# Altium schematic sheet 0254_GPU POWER SEQUENCI.SchDoc
size 848 x 558 mm
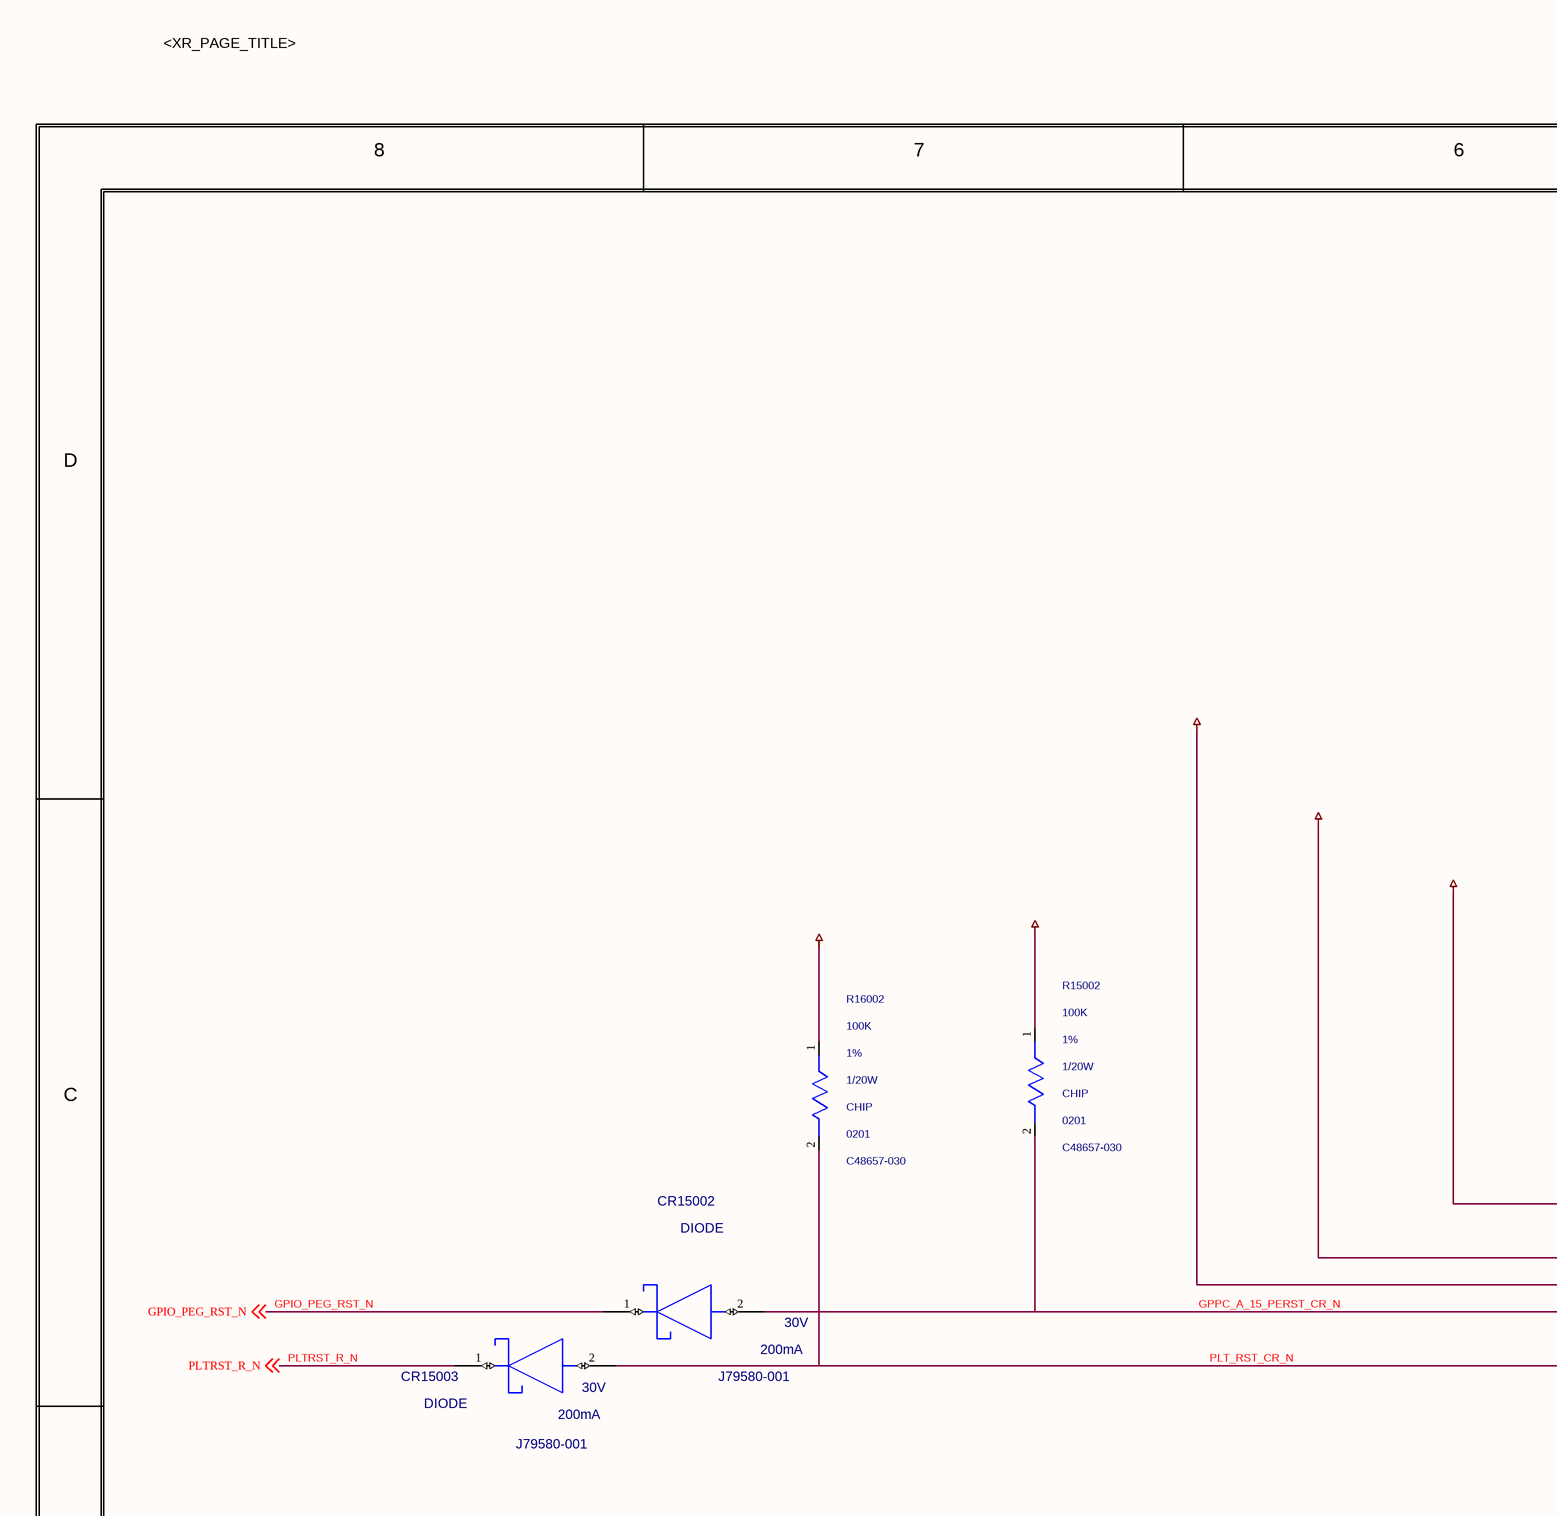
[diagram p0: 0254_GPU POWER SEQUENCI.SchDoc, top left]
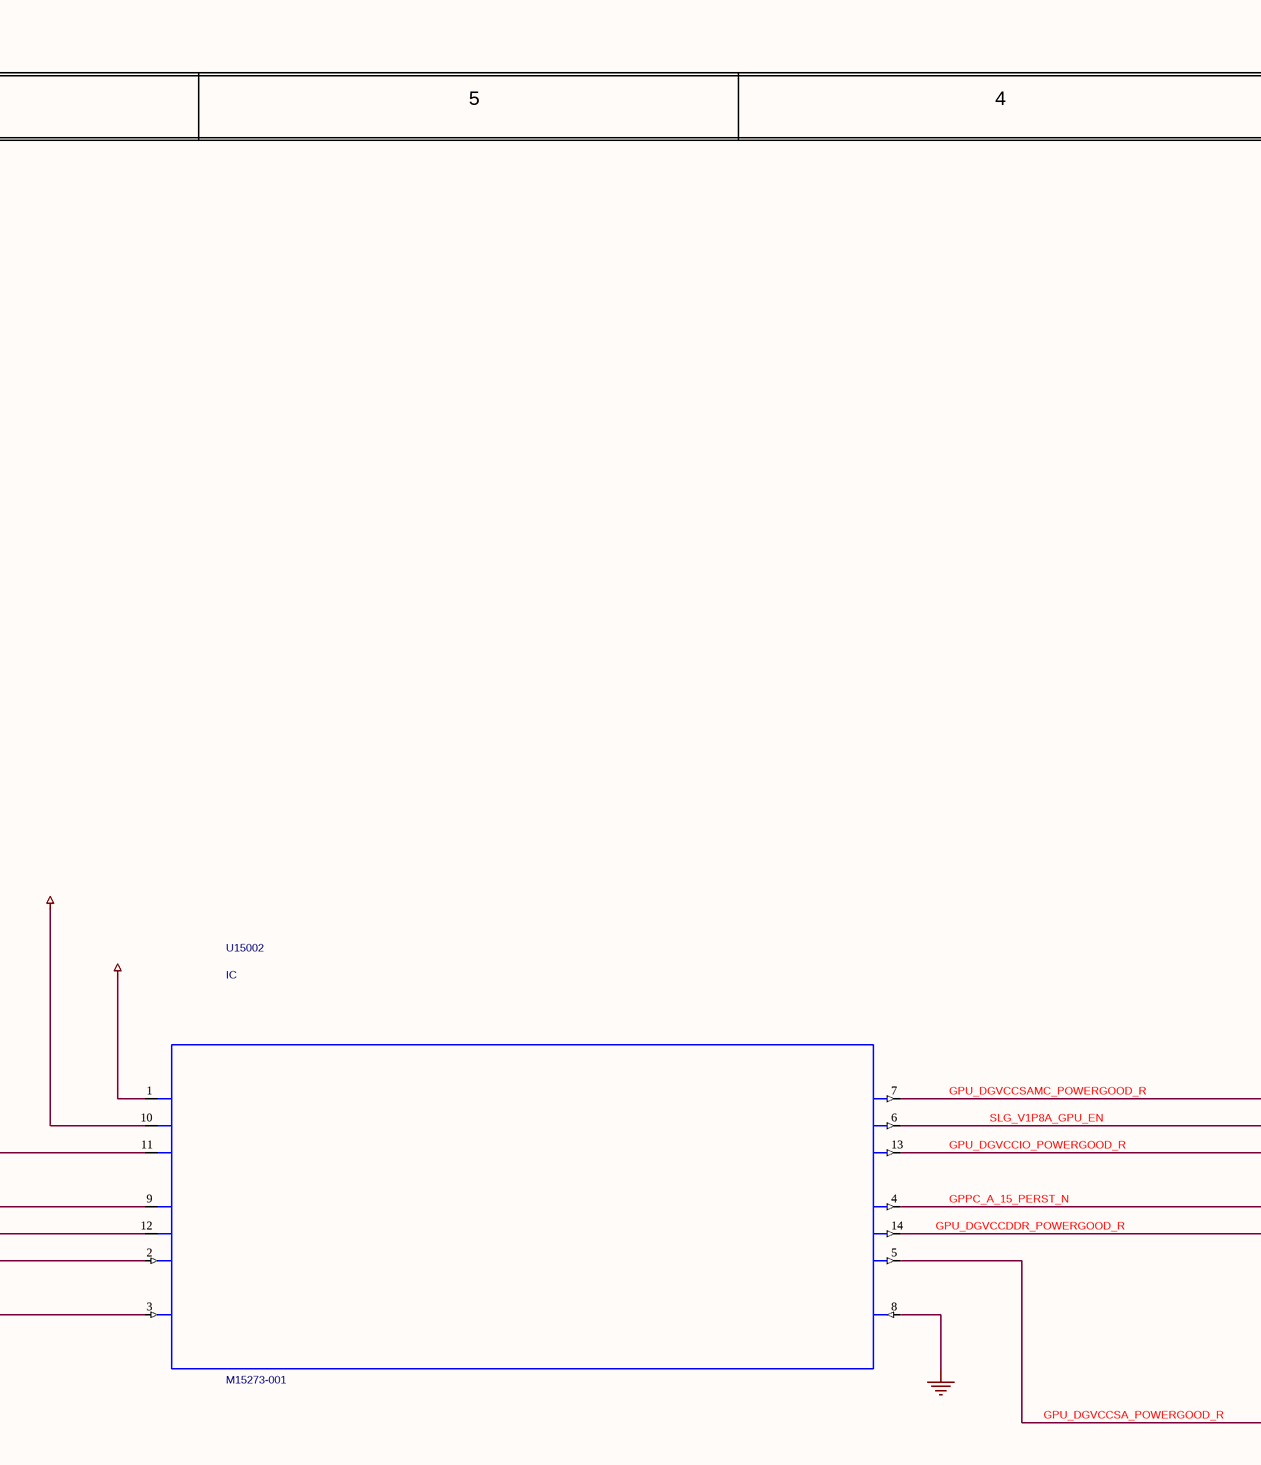
[diagram p1: 0254_GPU POWER SEQUENCI.SchDoc, top middle]
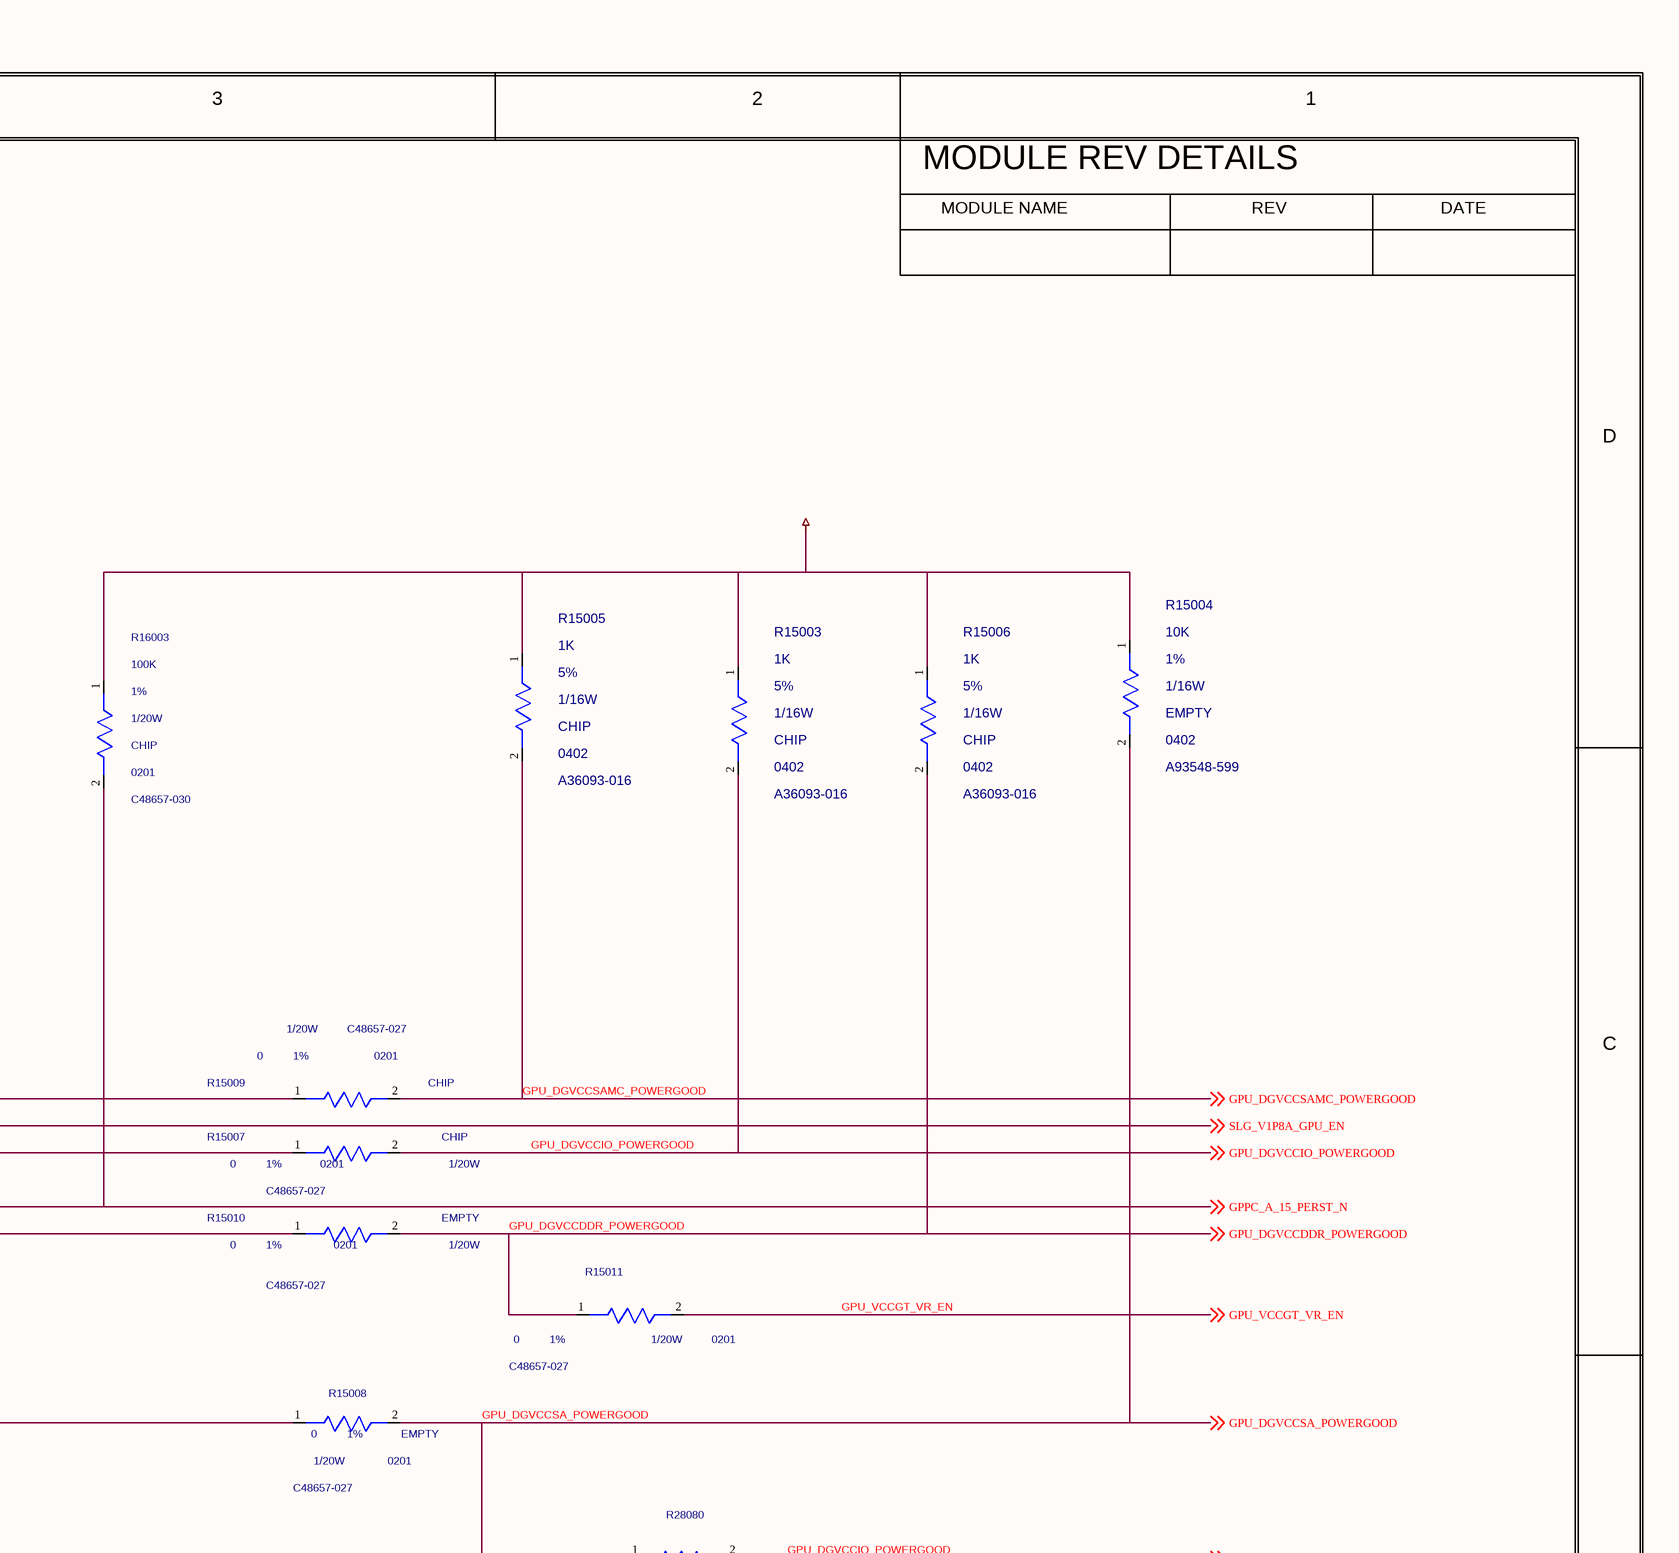
[diagram p2: 0254_GPU POWER SEQUENCI.SchDoc, top right]
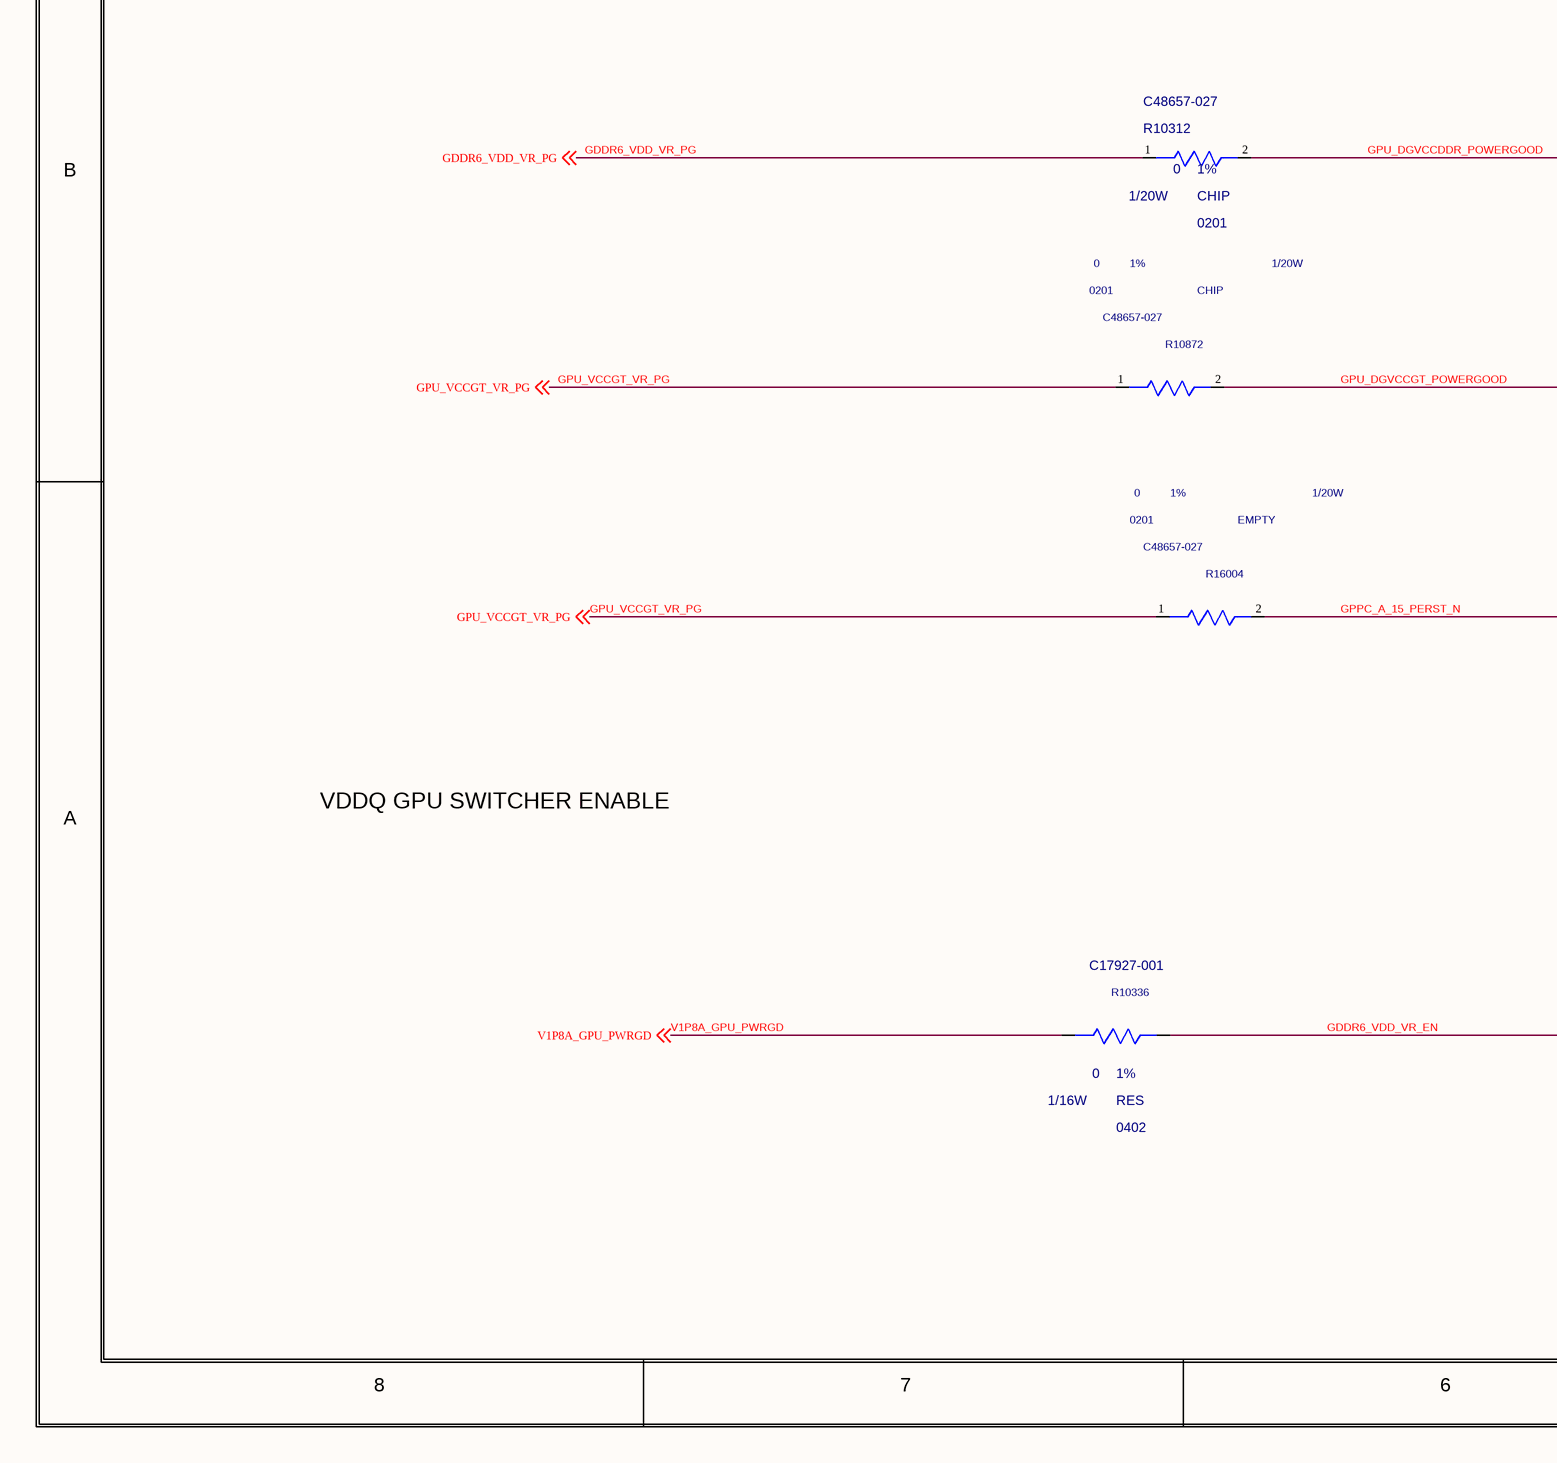
[diagram p3: 0254_GPU POWER SEQUENCI.SchDoc, bottom left]
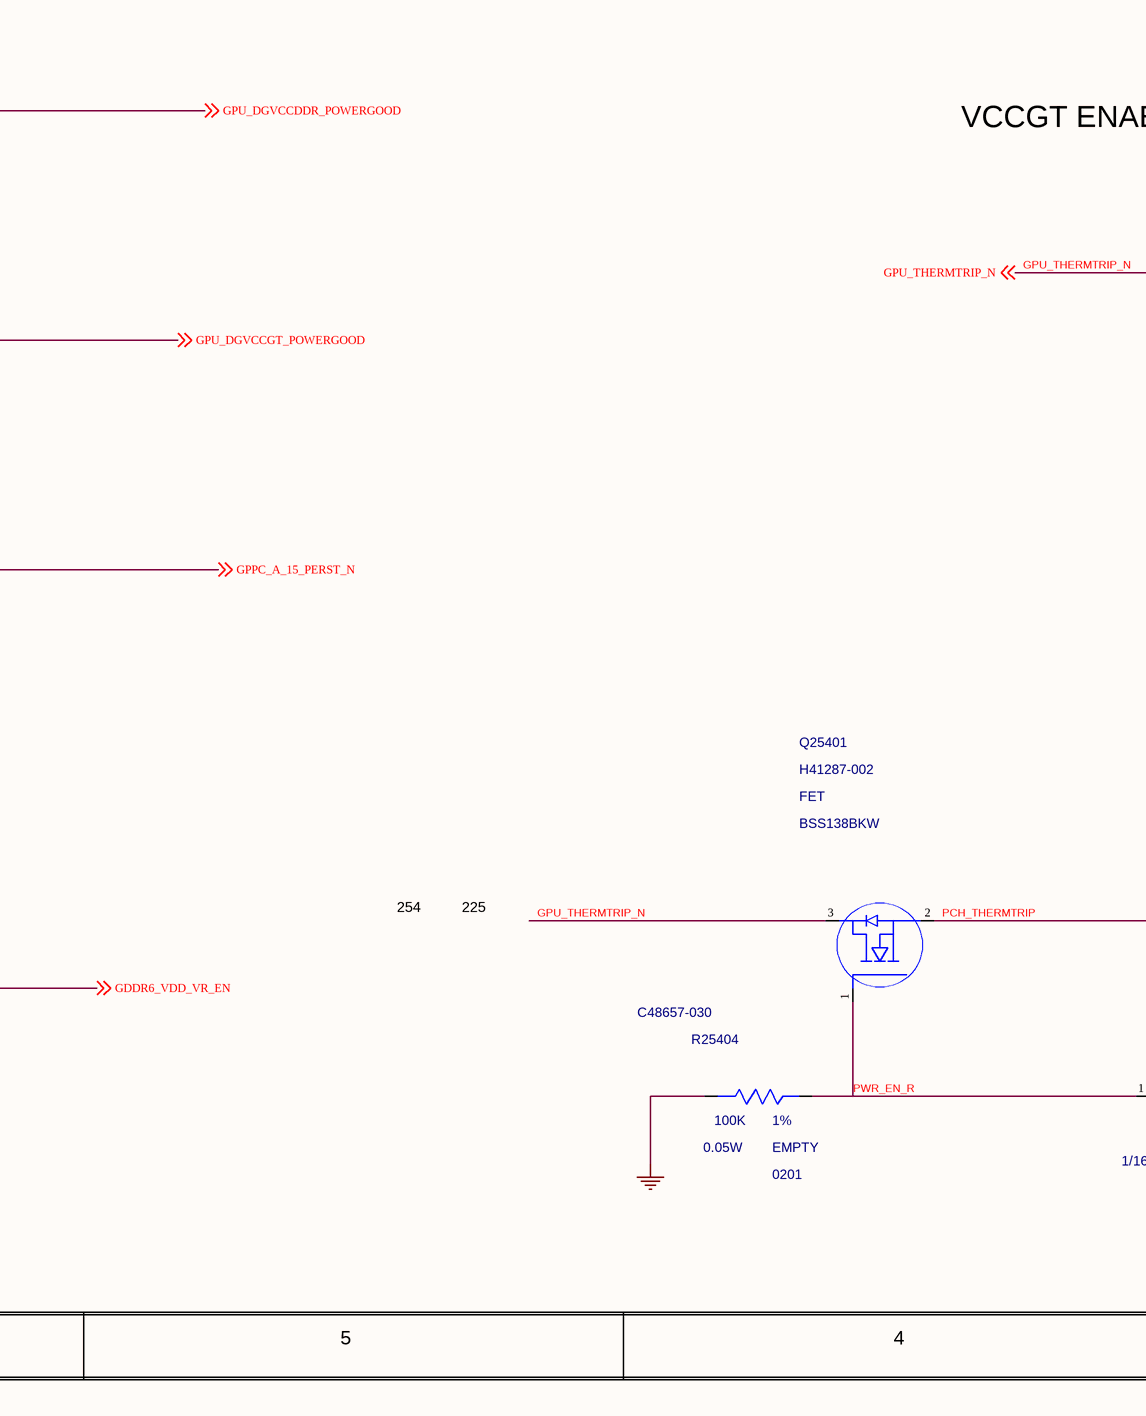
[diagram p4: 0254_GPU POWER SEQUENCI.SchDoc, bottom middle]
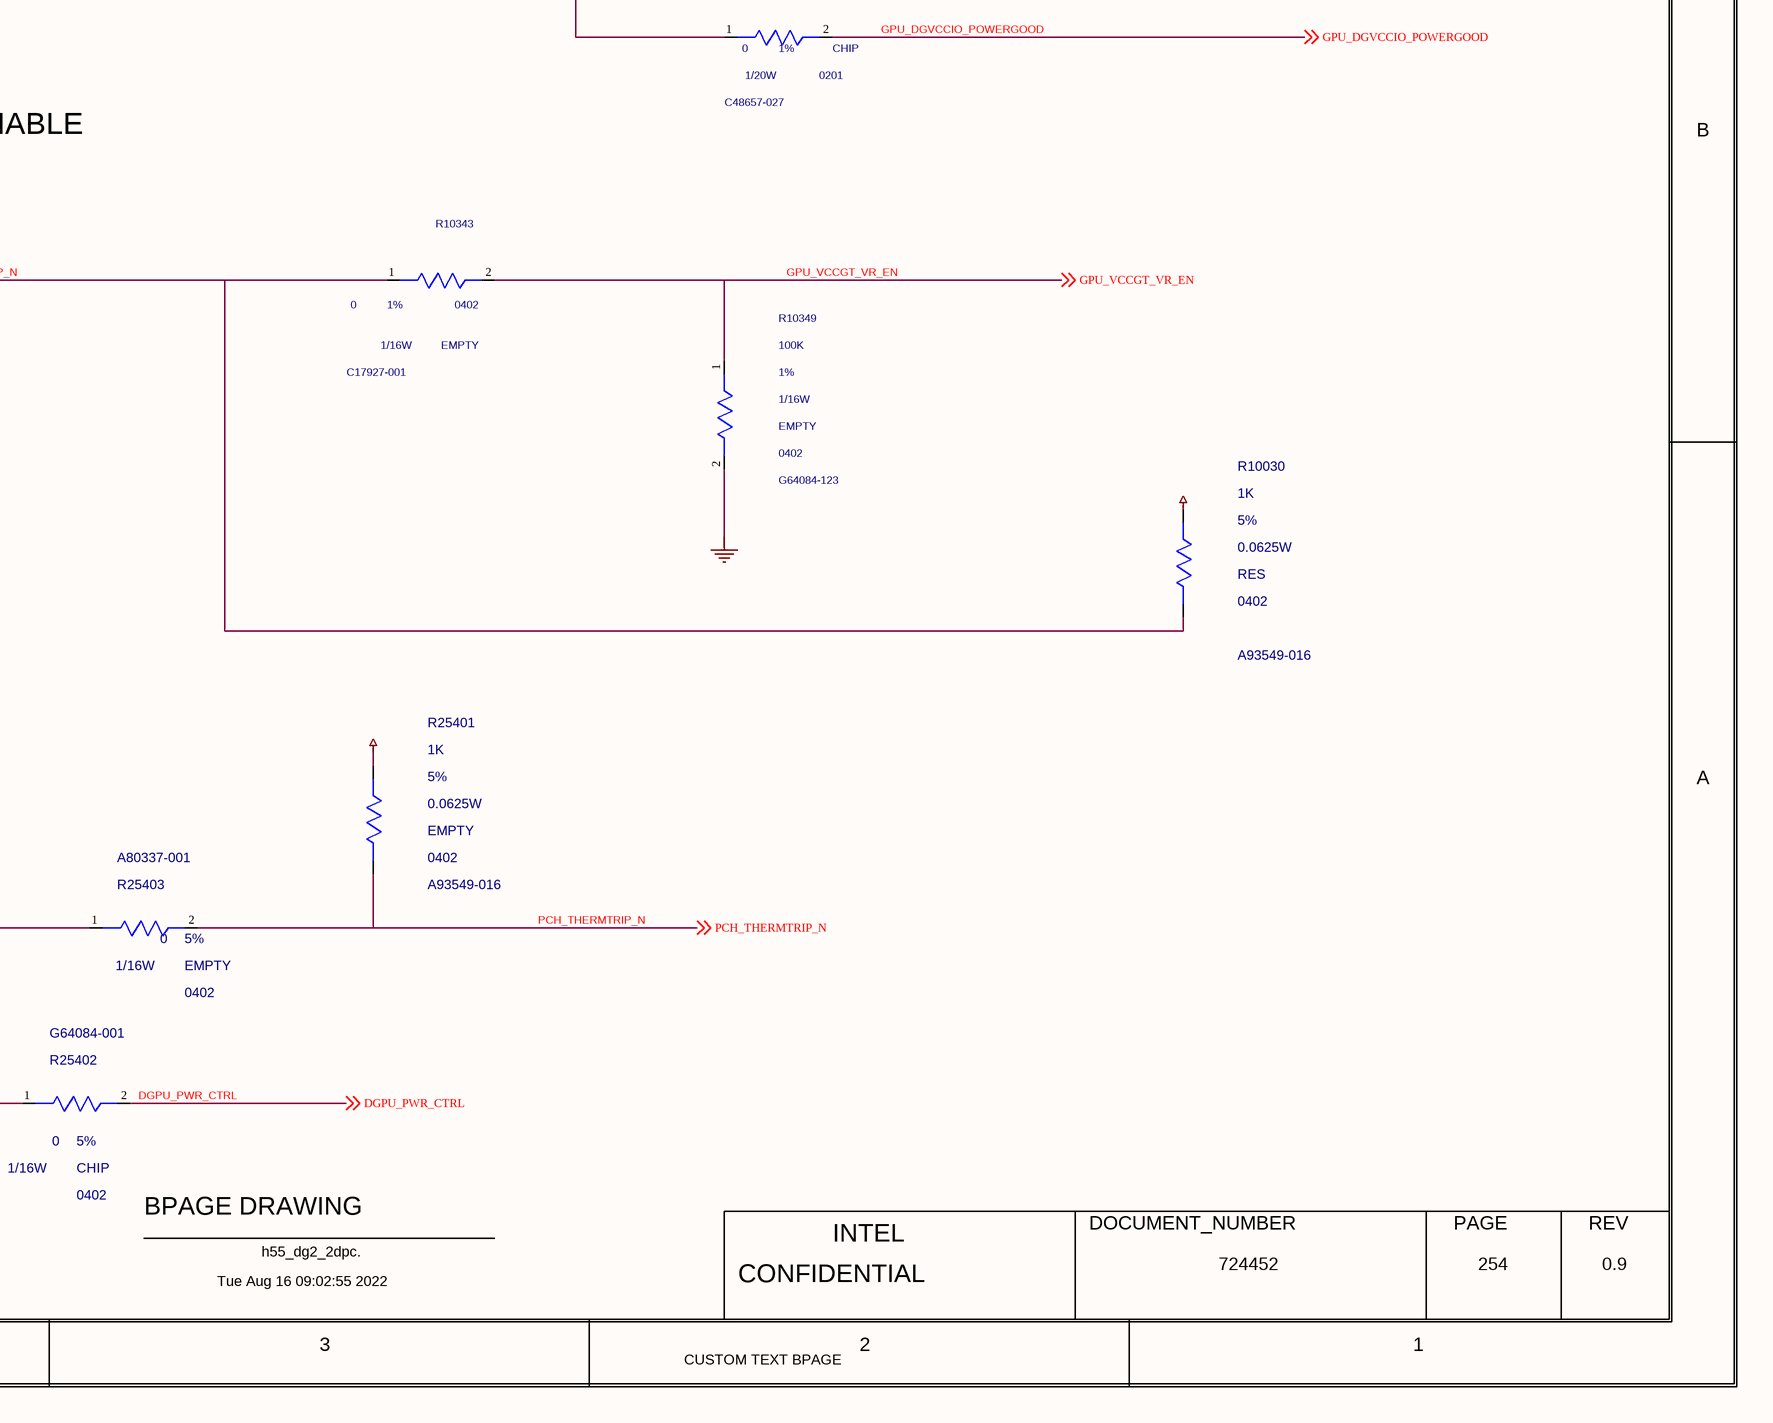
[diagram p5: 0254_GPU POWER SEQUENCI.SchDoc, bottom right]

## Parts
CR15002  30V  CURRENT: 200mA  MATERIAL: DIODE  PART_NUMBER: J79580-001  [SCR65X35MA]
CR15003  30V  CURRENT: 200mA  MATERIAL: DIODE  PART_NUMBER: J79580-001  [SCR65X35MA]
Q25401  BSS138BKW  MATERIAL: FET  PART_NUMBER: H41287-002  [SOT323MA]
R10030  1K  MATERIAL: RES  PACK_TYPE: 0402  PART_NUMBER: A93549-016  TOLERANCE: 5%  WATTAGE: 0.0625W  [CTK2_SM0402_1050X550_MA]
R10312  0  MATERIAL: CHIP  PACK_TYPE: 0201  PART_NUMBER: C48657-027  TOLERANCE: 1%  WATTAGE: 1/20W  [SMR0201IA]
R10336  0  MATERIAL: RES  PACK_TYPE: 0402  PART_NUMBER: C17927-001  TOLERANCE: 1%  WATTAGE: 1/16W  [TK0_SM0402_1100X550_MA]
R10343  0  MATERIAL: EMPTY  PACK_TYPE: 0402  PART_NUMBER: C17927-001  TOLERANCE: 1%  WATTAGE: 1/16W  [SMR0402IA]
R10349  100K  MATERIAL: EMPTY  PACK_TYPE: 0402  PART_NUMBER: G64084-123  TOLERANCE: 1%  WATTAGE: 1/16W  [SMR0402IA]
R10872  0  MATERIAL: CHIP  PACK_TYPE: 0201  PART_NUMBER: C48657-027  TOLERANCE: 1%  WATTAGE: 1/20W  [SMR0201IA]
R15002  100K  MATERIAL: CHIP  PACK_TYPE: 0201  PART_NUMBER: C48657-030  TOLERANCE: 1%  WATTAGE: 1/20W  [SMR0201MC]
R15003  1K  MATERIAL: CHIP  PACK_TYPE: 0402  PART_NUMBER: A36093-016  TOLERANCE: 5%  WATTAGE: 1/16W  [SMR0402IA]
R15004  10K  MATERIAL: EMPTY  PACK_TYPE: 0402  PART_NUMBER: A93548-599  TOLERANCE: 1%  WATTAGE: 1/16W  [SMR0402IA]
R15005  1K  MATERIAL: CHIP  PACK_TYPE: 0402  PART_NUMBER: A36093-016  TOLERANCE: 5%  WATTAGE: 1/16W  [SMR0402IA]
R15006  1K  MATERIAL: CHIP  PACK_TYPE: 0402  PART_NUMBER: A36093-016  TOLERANCE: 5%  WATTAGE: 1/16W  [SMR0402IA]
R15007  0  MATERIAL: CHIP  PACK_TYPE: 0201  PART_NUMBER: C48657-027  TOLERANCE: 1%  WATTAGE: 1/20W  [SMR0201IA]
R15008  0  MATERIAL: EMPTY  PACK_TYPE: 0201  PART_NUMBER: C48657-027  TOLERANCE: 1%  WATTAGE: 1/20W  [SMR0201IA]
R15009  0  MATERIAL: CHIP  PACK_TYPE: 0201  PART_NUMBER: C48657-027  TOLERANCE: 1%  WATTAGE: 1/20W  [SMR0201IA]
R15010  0  MATERIAL: EMPTY  PACK_TYPE: 0201  PART_NUMBER: C48657-027  TOLERANCE: 1%  WATTAGE: 1/20W  [SMR0201IA]
R15011  0  PACK_TYPE: 0201  PART_NUMBER: C48657-027  TOLERANCE: 1%  WATTAGE: 1/20W  [SMR0201IA]
R16002  100K  MATERIAL: CHIP  PACK_TYPE: 0201  PART_NUMBER: C48657-030  TOLERANCE: 1%  WATTAGE: 1/20W  [SMR0201MC]
R16003  100K  MATERIAL: CHIP  PACK_TYPE: 0201  PART_NUMBER: C48657-030  TOLERANCE: 1%  WATTAGE: 1/20W  [SMR0201MC]
R16004  0  MATERIAL: EMPTY  PACK_TYPE: 0201  PART_NUMBER: C48657-027  TOLERANCE: 1%  WATTAGE: 1/20W  [SMR0201IA]
R25401  1K  MATERIAL: EMPTY  PACK_TYPE: 0402  PART_NUMBER: A93549-016  TOLERANCE: 5%  WATTAGE: 0.0625W  [CTK2_SM0402_1050X550_MA]
R25402  0  MATERIAL: CHIP  PACK_TYPE: 0402  PART_NUMBER: G64084-001  TOLERANCE: 5%  WATTAGE: 1/16W  [SMR0402IA]
R25403  0  MATERIAL: EMPTY  PACK_TYPE: 0402  PART_NUMBER: A80337-001  TOLERANCE: 5%  WATTAGE: 1/16W  [SMR0402IA]
R25404  100K  MATERIAL: EMPTY  PACK_TYPE: 0201  PART_NUMBER: C48657-030  TOLERANCE: 1%  WATTAGE: 0.05W  [CTK2_SM0201_630X330_MA]
R28080  0  MATERIAL: CHIP  PACK_TYPE: 0201  PART_NUMBER: C48657-027  TOLERANCE: 1%  WATTAGE: 1/20W  [SMR0201IA]
U15002  MATERIAL: IC  PART_NUMBER: M15273-001  [CTK1_LCC14_1650X2050_400_MA]  (hidden comment: C_SLG7NT44244)

## Nets
+V1P8S_GPU: R10030.1(A) R15003.1(A) R15004.1(A) R15005.1(A) R15006.1(A) R16003.1(A) U15002.10(P_V1P8A_GPU)
+V3P3S_GPU: R15002.1(A) R16002.1(A) U15002.1(VDD)
+VCC1P05_PROC: R25401.1(A)
+VCCSA_GPU: U15002.9(P_VCCSA)
+VCCSAMC_GPU: U15002.11(P_VCCSAMC)
+VDDQ_GPU: U15002.12(P_VDDQ_GPU)
GND: R10349.2(B) R25404.1(A) U15002.8(GND)
DGPU_PWR_CTRL: R25402.2(B) ; off-sheet DGPU_PWR_CTRL
GDDR6_VDD_VR_EN: R10336.2(B) ; off-sheet GDDR6_VDD_VR_EN
GDDR6_VDD_VR_PG: R10312.1(A) ; off-sheet GDDR6_VDD_VR_PG
GPIO_PEG_RST_N: CR15002.1(CATHODE) ; off-sheet GPIO_PEG_RST_N
GPPC_A_15_PERST_CR_N: CR15002.2(ANODE) R15002.2(B) U15002.2(GPPC_A_15_PERST_R_N)
GPPC_A_15_PERST_N: R16003.2(B) R16004.2(B) U15002.4(GPPC_A_15_PERST_N) ; off-sheet GPPC_A_15_PERST_N
GPU_DGVCCDDR_POWERGOOD: R10312.2(B) R15006.2(B) R15010.2(B) R15011.1(A) ; off-sheet GPU_DGVCCDDR_POWERGOOD
GPU_DGVCCDDR_POWERGOOD_R: R15010.1(A) U15002.14(DGVCCDDR_POWERGOOD)
GPU_DGVCCGT_POWERGOOD: R10872.2(B) ; off-sheet GPU_DGVCCGT_POWERGOOD
GPU_DGVCCIO_POWERGOOD: R15003.2(B) R15007.2(B) R28080.2(B) ; off-sheet GPU_DGVCCIO_POWERGOOD
GPU_DGVCCIO_POWERGOOD_R: R15007.1(A) U15002.13(DGVCCIO_POWERGOOD)
GPU_DGVCCSA_POWERGOOD: R15004.2(B) R15008.2(B) R28080.1(A) ; off-sheet GPU_DGVCCSA_POWERGOOD
GPU_DGVCCSA_POWERGOOD_R: R15008.1(A) U15002.5(DGVCCSA_POWERGOOD)
GPU_DGVCCSAMC_POWERGOOD: R15005.2(B) R15009.2(B) ; off-sheet GPU_DGVCCSAMC_POWERGOOD
GPU_DGVCCSAMC_POWERGOOD_R: R15009.1(A) U15002.7(DGVCCSAMC_POWERGOOD)
GPU_THERMTRIP_N: Q25401.3(DRN) R10030.2(B) R10343.1(A) ; off-sheet GPU_THERMTRIP_N
GPU_VCCGT_VR_EN: R10343.2(B) R10349.1(A) R15011.2(B) ; off-sheet GPU_VCCGT_VR_EN
GPU_VCCGT_VR_PG: R10872.1(A) R16004.1(A) ; off-sheet GPU_VCCGT_VR_PG
PCH_THERMTRIP: Q25401.2(SRC) R25403.1(A)
PCH_THERMTRIP_N: R25401.2(B) R25403.2(B) ; off-sheet PCH_THERMTRIP_N
PLT_RST_CR_N: CR15003.2(ANODE) R16002.2(B) U15002.3(PLT_RST_N)
PLTRST_R_N: CR15003.1(CATHODE) ; off-sheet PLTRST_R_N
PWR_EN_R: Q25401.1(GATE) R25402.1(A) R25404.2(B)
SLG_V1P8A_GPU_EN: U15002.6(V1P8_EN) ; off-sheet SLG_V1P8A_GPU_EN
V1P8A_GPU_PWRGD: R10336.1(A) ; off-sheet V1P8A_GPU_PWRGD

## Notes on the sheet
- <XR_PAGE_TITLE>
- 8
- 7
- 6
- 5
- 4
- 3
- 2
- 1
- MODULE REV DETAILS
- MODULE NAME
- REV
- DATE
- D
- C
- B
- VCCGT ENABLE
- VDDQ GPU SWITCHER ENABLE
- A
- 254
- 225
- BPAGE DRAWING
- INTEL
- DOCUMENT_NUMBER
- PAGE
- Tue Aug 16 09:02:55 2022
- h55_dg2_2dpc.
- CONFIDENTIAL
- 724452
- 0.9
- CUSTOM TEXT BPAGE

## Library data of the parts
CR15002 = DIODE_SCHOTTKY: CDS_PHYS_PART_NAME: DIODE_SCHOTTKY_SM-J79580-001,DIODE,30V,200MA,LPDB,GENERIC; CDS_LMAN_SYM_OUTLINE: -50,100,50,-100; PACK_TYPE: SM; OriginalSymbolOrigin: (-75,50); XY: (-7025,3500); VER: 1; ROT: 2; PHYS_PAGE: 254; LOCATION: CR15002; IP: GENERIC; FP_TECH: LPDB; DRAWING: @RVP1_ADL_SB_ADP_S_DDR5_SODIMM_2DPC_LIB.H55_DG2_2DPC(SCH_1):PAGE366; CDS_LIB: discrete; PCB Footprint: SCR65X35MA; CHIPS_PART_NAME: DIODE_SCHOTTKY; CDS_PART_NAME: DIODE_SCHOTTKY_SM-J79580-001,DIODE,30V,200MA,LPDB,GENERIC; CDS_LOCATION: CR15002
CR15003 = DIODE_SCHOTTKY: CDS_PHYS_PART_NAME: DIODE_SCHOTTKY_SM-J79580-001,DIODE,30V,200MA,LPDB,GENERIC; CDS_LMAN_SYM_OUTLINE: -50,100,50,-100; PACK_TYPE: SM; OriginalSymbolOrigin: (-75,50); XY: (-7300,3400); VER: 1; ROT: 2; PHYS_PAGE: 254; LOCATION: CR15003; IP: GENERIC; FP_TECH: LPDB; DRAWING: @RVP1_ADL_SB_ADP_S_DDR5_SODIMM_2DPC_LIB.H55_DG2_2DPC(SCH_1):PAGE366; CDS_LIB: discrete; PCB Footprint: SCR65X35MA; CHIPS_PART_NAME: DIODE_SCHOTTKY; CDS_PART_NAME: DIODE_SCHOTTKY_SM-J79580-001,DIODE,30V,200MA,LPDB,GENERIC; CDS_LOCATION: CR15003
Q25401 = MOSFET_N#2: CDS_PHYS_PART_NAME: MOSFET_N_SOT323-H41287-002,FET,BSS138BKW,LPDB,GENERIC; CDS_LMAN_SYM_OUTLINE: -100,100,100,-100; PACK_TYPE: SOT323; OriginalSymbolOrigin: (-75,75); XY: (-3625,1250); VER: 7; ROT: 4; PHYS_PAGE: 254; LOCATION: Q25401; IP: GENERIC; FP_TECH: LPDB; DRAWING: @RVP1_ADL_SB_ADP_S_DDR5_SODIMM_2DPC_LIB.H55_DG2_2DPC(SCH_1):PAGE366; CDS_LIB: discrete; PCB Footprint: SOT323MA; SEC_TYPE: SOT323; CHIPS_PART_NAME: MOSFET_N; CDS_PART_NAME: MOSFET_N_SOT323-H41287-002,FET,BSS138BKW,LPDB,GENERIC; CDS_LOCATION: Q25401
R10030 = C_RES: CDS_PHYS_PART_NAME: C_RES_0402-A93549-016,RES,1K,5%,0.0625W,TK2,GENERIC; CDS_LMAN_SYM_OUTLINE: -50,50,50,-50; FP_TECH: TK2; IP: GENERIC; ROOM: NONE; OriginalSymbolOrigin: (-25,75); XY: (-1000,1975); VER: 2; ROT: 0; PHYS_PAGE: 254; LOCATION: R10030; DRAWING: @RVP1_ADL_SB_ADP_S_DDR5_SODIMM_2DPC_LIB.H55_DG2_2DPC(SCH_1):PAGE366; CDS_LIB: c_discrete; VARIANT: ?; PCB Footprint: CTK2_SM0402_1050X550_MA; CHIPS_PART_NAME: C_RES; CDS_PART_NAME: C_RES_0402-A93549-016,RES,1K,5%,0.0625W,TK2,GENERIC; CDS_LOCATION: R10030
R10312 = RES#1: CHIPS_PART_NAME: RES; CDS_PHYS_PART_NAME: RES_0201-C48657-027,CHIP,0,1%,1/20W,LPDB,GENERIC; OriginalSymbolOrigin: (-75,25); XY: (-6075,2800); VER: 1; PHYS_PAGE: 254; LOCATION: R10312; IP: GENERIC; FP_TECH: LPDB; DRAWING: @RVP1_ADL_SB_ADP_S_DDR5_SODIMM_2DPC_LIB.H55_DG2_2DPC(SCH_1):PAGE366; CDS_LIB: discrete; PCB Footprint: SMR0201IA; ROT: 0; CDS_PART_NAME: RES_0201-C48657-027,CHIP,0,1%,1/20W,LPDB,GENERIC; CDS_LOCATION: R10312
R10336 = RES_2#1: CHIPS_PART_NAME: RES_2; CDS_PHYS_PART_NAME: RES_2_0402-C17927-001,RES,0,1%,1/16W,TK0,GENERIC; BOM_USE: STUFF; CDS_LMAN_SYM_OUTLINE: -50,50,50,-50; FP_TECH: TK0; IP: GENERIC; ROOM: NONE; OriginalSymbolOrigin: (-75,25); XY: (-6225,1175); VER: 1; PHYS_PAGE: 254; LOCATION: R10336; DRAWING: @RVP1_ADL_SB_ADP_S_DDR5_SODIMM_2DPC_LIB.H55_DG2_2DPC(SCH_1):PAGE366; CDS_LIB: discrete_2; VARIANT: ?; PCB Footprint: TK0_SM0402_1100X550_MA; ROT: 0; CDS_PART_NAME: RES_2_0402-C17927-001,RES,0,1%,1/16W,TK0,GENERIC; CDS_LOCATION: R10336
R10343 = RES#1: CHIPS_PART_NAME: RES; CDS_PHYS_PART_NAME: RES_0402-C17927-001,EMPTY,0,1%,1/16W,LPDB,GENERIC; OriginalSymbolOrigin: (-75,25); XY: (-2375,2500); VER: 1; PHYS_PAGE: 254; LOCATION: R10343; DRAWING: @RVP1_ADL_SB_ADP_S_DDR5_SODIMM_2DPC_LIB.H55_DG2_2DPC(SCH_1):PAGE366; CDS_LIB: discrete; PCB Footprint: SMR0402IA; ROT: 0; CDS_PART_NAME: RES_0402-C17927-001,EMPTY,0,1%,1/16W,LPDB,GENERIC; CDS_LOCATION: R10343
R10349 = RES: CDS_PHYS_PART_NAME: RES_0402-G64084-123,EMPTY,100K,1%,1/16W,LPDB,GENERIC; OriginalSymbolOrigin: (-25,75); XY: (-1850,2250); VER: 2; ROT: 0; PHYS_PAGE: 254; LOCATION: R10349; IP: GENERIC; FP_TECH: LPDB; DRAWING: @RVP1_ADL_SB_ADP_S_DDR5_SODIMM_2DPC_LIB.H55_DG2_2DPC(SCH_1):PAGE366; CDS_LIB: discrete; PCB Footprint: SMR0402IA; CHIPS_PART_NAME: RES; CDS_PART_NAME: RES_0402-G64084-123,EMPTY,100K,1%,1/16W,LPDB,GENERIC; CDS_LOCATION: R10349
R10872 = RES#1: CHIPS_PART_NAME: RES; CDS_PHYS_PART_NAME: RES_0201-C48657-027,CHIP,0,1%,1/20W,LPDB,GENERIC; OriginalSymbolOrigin: (-75,25); XY: (-6125,2375); VER: 1; PHYS_PAGE: 254; LOCATION: R10872; DRAWING: @RVP1_ADL_SB_ADP_S_DDR5_SODIMM_2DPC_LIB.H55_DG2_2DPC(SCH_1):PAGE366; CDS_LIB: discrete; PCB Footprint: SMR0201IA; ROT: 0; CDS_PART_NAME: RES_0201-C48657-027,CHIP,0,1%,1/20W,LPDB,GENERIC; CDS_LOCATION: R10872
R15002 = RES: CDS_PHYS_PART_NAME: RES_0201-C48657-030,CHIP,100K,1%,1/20W,LPDB,GENERIC; OriginalSymbolOrigin: (-25,75); XY: (-6375,3925); VER: 2; ROT: 0; PHYS_PAGE: 254; LOCATION: R15002; FP_TECH: LPDB; DRAWING: @RVP1_ADL_SB_ADP_S_DDR5_SODIMM_2DPC_LIB.H55_DG2_2DPC(SCH_1):PAGE366; CDS_LIB: discrete; PCB Footprint: SMR0201MC; CHIPS_PART_NAME: RES; CDS_PART_NAME: RES_0201-C48657-030,CHIP,100K,1%,1/20W,LPDB,GENERIC; CDS_LOCATION: R15002
R15003 = RES: CDS_PHYS_PART_NAME: RES_0402-A36093-016,CHIP,1K,5%,1/16W,LPDB,GENERIC; OriginalSymbolOrigin: (-25,75); XY: (-1650,4500); VER: 2; ROT: 0; PHYS_PAGE: 254; LOCATION: R15003; IP: GENERIC; FP_TECH: LPDB; DRAWING: @RVP1_ADL_SB_ADP_S_DDR5_SODIMM_2DPC_LIB.H55_DG2_2DPC(SCH_1):PAGE366; CDS_LIB: discrete; PCB Footprint: SMR0402IA; CHIPS_PART_NAME: RES; CDS_PART_NAME: RES_0402-A36093-016,CHIP,1K,5%,1/16W,LPDB,GENERIC; CDS_LOCATION: R15003
R15004 = RES: CDS_PHYS_PART_NAME: RES_0402-A93548-599,EMPTY,10K,1%,1/16W,LPDB,GENERIC; OriginalSymbolOrigin: (-25,75); XY: (-925,4550); VER: 2; ROT: 0; PHYS_PAGE: 254; LOCATION: R15004; IP: GENERIC; FP_TECH: LPDB; DRAWING: @RVP1_ADL_SB_ADP_S_DDR5_SODIMM_2DPC_LIB.H55_DG2_2DPC(SCH_1):PAGE366; CDS_LIB: discrete; PCB Footprint: SMR0402IA; CHIPS_PART_NAME: RES; CDS_PART_NAME: RES_0402-A93548-599,EMPTY,10K,1%,1/16W,LPDB,GENERIC; CDS_LOCATION: R15004
R15005 = RES: CDS_PHYS_PART_NAME: RES_0402-A36093-016,CHIP,1K,5%,1/16W,LPDB,GENERIC; OriginalSymbolOrigin: (-25,75); XY: (-2050,4525); VER: 2; ROT: 0; PHYS_PAGE: 254; LOCATION: R15005; IP: GENERIC; FP_TECH: LPDB; DRAWING: @RVP1_ADL_SB_ADP_S_DDR5_SODIMM_2DPC_LIB.H55_DG2_2DPC(SCH_1):PAGE366; CDS_LIB: discrete; PCB Footprint: SMR0402IA; CHIPS_PART_NAME: RES; CDS_PART_NAME: RES_0402-A36093-016,CHIP,1K,5%,1/16W,LPDB,GENERIC; CDS_LOCATION: R15005
R15006 = RES: CDS_PHYS_PART_NAME: RES_0402-A36093-016,CHIP,1K,5%,1/16W,LPDB,GENERIC; OriginalSymbolOrigin: (-25,75); XY: (-1300,4500); VER: 2; ROT: 0; PHYS_PAGE: 254; LOCATION: R15006; IP: GENERIC; FP_TECH: LPDB; DRAWING: @RVP1_ADL_SB_ADP_S_DDR5_SODIMM_2DPC_LIB.H55_DG2_2DPC(SCH_1):PAGE366; CDS_LIB: discrete; PCB Footprint: SMR0402IA; CHIPS_PART_NAME: RES; CDS_PART_NAME: RES_0402-A36093-016,CHIP,1K,5%,1/16W,LPDB,GENERIC; CDS_LOCATION: R15006
R15007 = RES#1: CHIPS_PART_NAME: RES; CDS_PHYS_PART_NAME: RES_0201-C48657-027,CHIP,0,1%,1/20W,LPDB,GENERIC; OriginalSymbolOrigin: (-75,25); XY: (-2375,3700); VER: 1; PHYS_PAGE: 254; LOCATION: R15007; DRAWING: @RVP1_ADL_SB_ADP_S_DDR5_SODIMM_2DPC_LIB.H55_DG2_2DPC(SCH_1):PAGE366; CDS_LIB: discrete; PCB Footprint: SMR0201IA; ROT: 0; CDS_PART_NAME: RES_0201-C48657-027,CHIP,0,1%,1/20W,LPDB,GENERIC; CDS_LOCATION: R15007
R15008 = RES#1: CHIPS_PART_NAME: RES; CDS_PHYS_PART_NAME: RES_0201-C48657-027,EMPTY,0,1%,1/20W,LPDB,GENERIC; OriginalSymbolOrigin: (-75,25); XY: (-2375,3200); VER: 1; PHYS_PAGE: 254; LOCATION: R15008; FP_TECH: LPDB; DRAWING: @RVP1_ADL_SB_ADP_S_DDR5_SODIMM_2DPC_LIB.H55_DG2_2DPC(SCH_1):PAGE366; CDS_LIB: discrete; PCB Footprint: SMR0201IA; ROT: 0; CDS_PART_NAME: RES_0201-C48657-027,EMPTY,0,1%,1/20W,LPDB,GENERIC; CDS_LOCATION: R15008
R15009 = RES#1: CHIPS_PART_NAME: RES; CDS_PHYS_PART_NAME: RES_0201-C48657-027,CHIP,0,1%,1/20W,LPDB,GENERIC; OriginalSymbolOrigin: (-75,25); XY: (-2375,3800); VER: 1; PHYS_PAGE: 254; LOCATION: R15009; DRAWING: @RVP1_ADL_SB_ADP_S_DDR5_SODIMM_2DPC_LIB.H55_DG2_2DPC(SCH_1):PAGE366; CDS_LIB: discrete; PCB Footprint: SMR0201IA; ROT: 0; CDS_PART_NAME: RES_0201-C48657-027,CHIP,0,1%,1/20W,LPDB,GENERIC; CDS_LOCATION: R15009
R15010 = RES#1: CHIPS_PART_NAME: RES; CDS_PHYS_PART_NAME: RES_0201-C48657-027,EMPTY,0,1%,1/20W,LPDB,GENERIC; OriginalSymbolOrigin: (-75,25); XY: (-2375,3550); VER: 1; PHYS_PAGE: 254; LOCATION: R15010; FP_TECH: LPDB; DRAWING: @RVP1_ADL_SB_ADP_S_DDR5_SODIMM_2DPC_LIB.H55_DG2_2DPC(SCH_1):PAGE366; CDS_LIB: discrete; PCB Footprint: SMR0201IA; ROT: 0; CDS_PART_NAME: RES_0201-C48657-027,EMPTY,0,1%,1/20W,LPDB,GENERIC; CDS_LOCATION: R15010
R15011 = RES#1: CHIPS_PART_NAME: RES; CDS_PHYS_PART_NAME: RES_0201-C48657-027,CHIP,0,1%,1/20W,LPDB,GENERIC; OriginalSymbolOrigin: (-75,25); XY: (-1850,3400); VER: 1; PHYS_PAGE: 254; LOCATION: R15011; DRAWING: @RVP1_ADL_SB_ADP_S_DDR5_SODIMM_2DPC_LIB.H55_DG2_2DPC(SCH_1):PAGE366; CDS_LIB: discrete; MATERIAL: CHIP; PCB Footprint: SMR0201IA; ROT: 0; CDS_PART_NAME: RES_0201-C48657-027,CHIP,0,1%,1/20W,LPDB,GENERIC; CDS_LOCATION: R15011
R16002 = RES: CDS_PHYS_PART_NAME: RES_0201-C48657-030,CHIP,100K,1%,1/20W,LPDB,GENERIC; OriginalSymbolOrigin: (-25,75); XY: (-6775,3900); VER: 2; ROT: 0; PHYS_PAGE: 254; LOCATION: R16002; FP_TECH: LPDB; DRAWING: @RVP1_ADL_SB_ADP_S_DDR5_SODIMM_2DPC_LIB.H55_DG2_2DPC(SCH_1):PAGE366; CDS_LIB: discrete; PCB Footprint: SMR0201MC; CHIPS_PART_NAME: RES; CDS_PART_NAME: RES_0201-C48657-030,CHIP,100K,1%,1/20W,LPDB,GENERIC; CDS_LOCATION: R16002
R16003 = RES: CDS_PHYS_PART_NAME: RES_0201-C48657-030,CHIP,100K,1%,1/20W,LPDB,GENERIC; OriginalSymbolOrigin: (-25,75); XY: (-2825,4475); VER: 2; ROT: 0; PHYS_PAGE: 254; LOCATION: R16003; FP_TECH: LPDB; DRAWING: @RVP1_ADL_SB_ADP_S_DDR5_SODIMM_2DPC_LIB.H55_DG2_2DPC(SCH_1):PAGE366; CDS_LIB: discrete; PCB Footprint: SMR0201MC; CHIPS_PART_NAME: RES; CDS_PART_NAME: RES_0201-C48657-030,CHIP,100K,1%,1/20W,LPDB,GENERIC; CDS_LOCATION: R16003
R16004 = RES#1: CHIPS_PART_NAME: RES; CDS_PHYS_PART_NAME: RES_0201-C48657-027,EMPTY,0,1%,1/20W,LPDB,GENERIC; OriginalSymbolOrigin: (-75,25); XY: (-6050,1950); VER: 1; PHYS_PAGE: 254; LOCATION: R16004; FP_TECH: LPDB; DRAWING: @RVP1_ADL_SB_ADP_S_DDR5_SODIMM_2DPC_LIB.H55_DG2_2DPC(SCH_1):PAGE366; CDS_LIB: discrete; PCB Footprint: SMR0201IA; ROT: 0; CDS_PART_NAME: RES_0201-C48657-027,EMPTY,0,1%,1/20W,LPDB,GENERIC; CDS_LOCATION: R16004
R25401 = C_RES: CDS_PHYS_PART_NAME: C_RES_0402-A93549-016,EMPTY,1K,5%,0.0625W,TK2,GENERIC; CDS_LMAN_SYM_OUTLINE: -50,50,50,-50; FP_TECH: TK2; IP: GENERIC; ROOM: NONE; OriginalSymbolOrigin: (-25,75); XY: (-2500,1500); VER: 2; ROT: 0; PHYS_PAGE: 254; LOCATION: R25401; DRAWING: @RVP1_ADL_SB_ADP_S_DDR5_SODIMM_2DPC_LIB.H55_DG2_2DPC(SCH_1):PAGE366; CDS_LIB: c_discrete; VARIANT: ?; PCB Footprint: CTK2_SM0402_1050X550_MA; CHIPS_PART_NAME: C_RES; CDS_PART_NAME: C_RES_0402-A93549-016,EMPTY,1K,5%,0.0625W,TK2,GENERIC; CDS_LOCATION: R25401
R25402 = RES#1: CHIPS_PART_NAME: RES; CDS_PHYS_PART_NAME: RES_0402-G64084-001,CHIP,0,5%,1/16W,LPDB,GENERIC; OriginalSymbolOrigin: (-75,25); XY: (-3050,975); VER: 1; PHYS_PAGE: 254; LOCATION: R25402; IP: GENERIC; FP_TECH: LPDB; DRAWING: @RVP1_ADL_SB_ADP_S_DDR5_SODIMM_2DPC_LIB.H55_DG2_2DPC(SCH_1):PAGE366; CDS_LIB: discrete; PCB Footprint: SMR0402IA; ROT: 0; CDS_PART_NAME: RES_0402-G64084-001,CHIP,0,5%,1/16W,LPDB,GENERIC; CDS_LOCATION: R25402
R25403 = RES#1: CHIPS_PART_NAME: RES; CDS_PHYS_PART_NAME: RES_0402-A80337-001,EMPTY,0,5%,1/16W,LPDB,GENERIC; OriginalSymbolOrigin: (-75,25); XY: (-2925,1300); VER: 1; PHYS_PAGE: 254; LOCATION: R25403; IP: GENERIC; FP_TECH: LPDB; DRAWING: @RVP1_ADL_SB_ADP_S_DDR5_SODIMM_2DPC_LIB.H55_DG2_2DPC(SCH_1):PAGE366; CDS_LIB: discrete; PCB Footprint: SMR0402IA; ROT: 0; CDS_PART_NAME: RES_0402-A80337-001,EMPTY,0,5%,1/16W,LPDB,GENERIC; CDS_LOCATION: R25403
R25404 = C_RES#1: CHIPS_PART_NAME: C_RES; CDS_PHYS_PART_NAME: C_RES_0201-C48657-030,EMPTY,100K,1%,0.05W,TK2,GENERIC; CDS_LMAN_SYM_OUTLINE: -50,50,50,-50; FP_TECH: TK2; IP: GENERIC; ROOM: NONE; OriginalSymbolOrigin: (-75,25); XY: (-3850,975); VER: 1; ROT: 0; PHYS_PAGE: 254; LOCATION: R25404; DRAWING: @RVP1_ADL_SB_ADP_S_DDR5_SODIMM_2DPC_LIB.H55_DG2_2DPC(SCH_1):PAGE366; CDS_LIB: c_discrete; VARIANT: ?; PCB Footprint: CTK2_SM0201_630X330_MA; CDS_PART_NAME: C_RES_0201-C48657-030,EMPTY,100K,1%,0.05W,TK2,GENERIC; CDS_LOCATION: R25404
R28080 = RES#1: CHIPS_PART_NAME: RES; CDS_PHYS_PART_NAME: RES_0201-C48657-027,CHIP,0,1%,1/20W,LPDB,GENERIC; OriginalSymbolOrigin: (-75,25); XY: (-1750,2950); VER: 1; PHYS_PAGE: 254; LOCATION: R28080; DRAWING: @RVP1_ADL_SB_ADP_S_DDR5_SODIMM_2DPC_LIB.H55_DG2_2DPC(SCH_1):PAGE366; CDS_LIB: discrete; PCB Footprint: SMR0201IA; ROT: 0; CDS_PART_NAME: RES_0201-C48657-027,CHIP,0,1%,1/20W,LPDB,GENERIC; CDS_LOCATION: R28080
U15002 = C_SLG7NT44244: CDS_PHYS_PART_NAME: C_SLG7NT44244_LCC-M15273-001,IC,SLG7NT44244V,TK1,GENERIC; CDS_LMAN_SYM_OUTLINE: -550,300,600,-300; FP_TECH: TK1; IP: GENERIC; PACK_TYPE: LCC; ROOM: NONE; OriginalSymbolOrigin: (-675,300); XY: (-4500,3600); VER: 1; ROT: 0; PHYS_PAGE: 254; LOCATION: U15002; DRAWING: @RVP1_ADL_SB_ADP_S_DDR5_SODIMM_2DPC_LIB.H55_DG2_2DPC(SCH_1):PAGE366; CDS_LIB: local; VARIANT: ?; PCB Footprint: CTK1_LCC14_1650X2050_400_MA; CHIPS_PART_NAME: C_SLG7NT44244; CDS_PART_NAME: C_SLG7NT44244_LCC-M15273-001,IC,SLG7NT44244V,TK1,GENERIC; CDS_LOCATION: U15002